# Altium schematic sheet OctopusBotV3R1.SchDoc
size A2
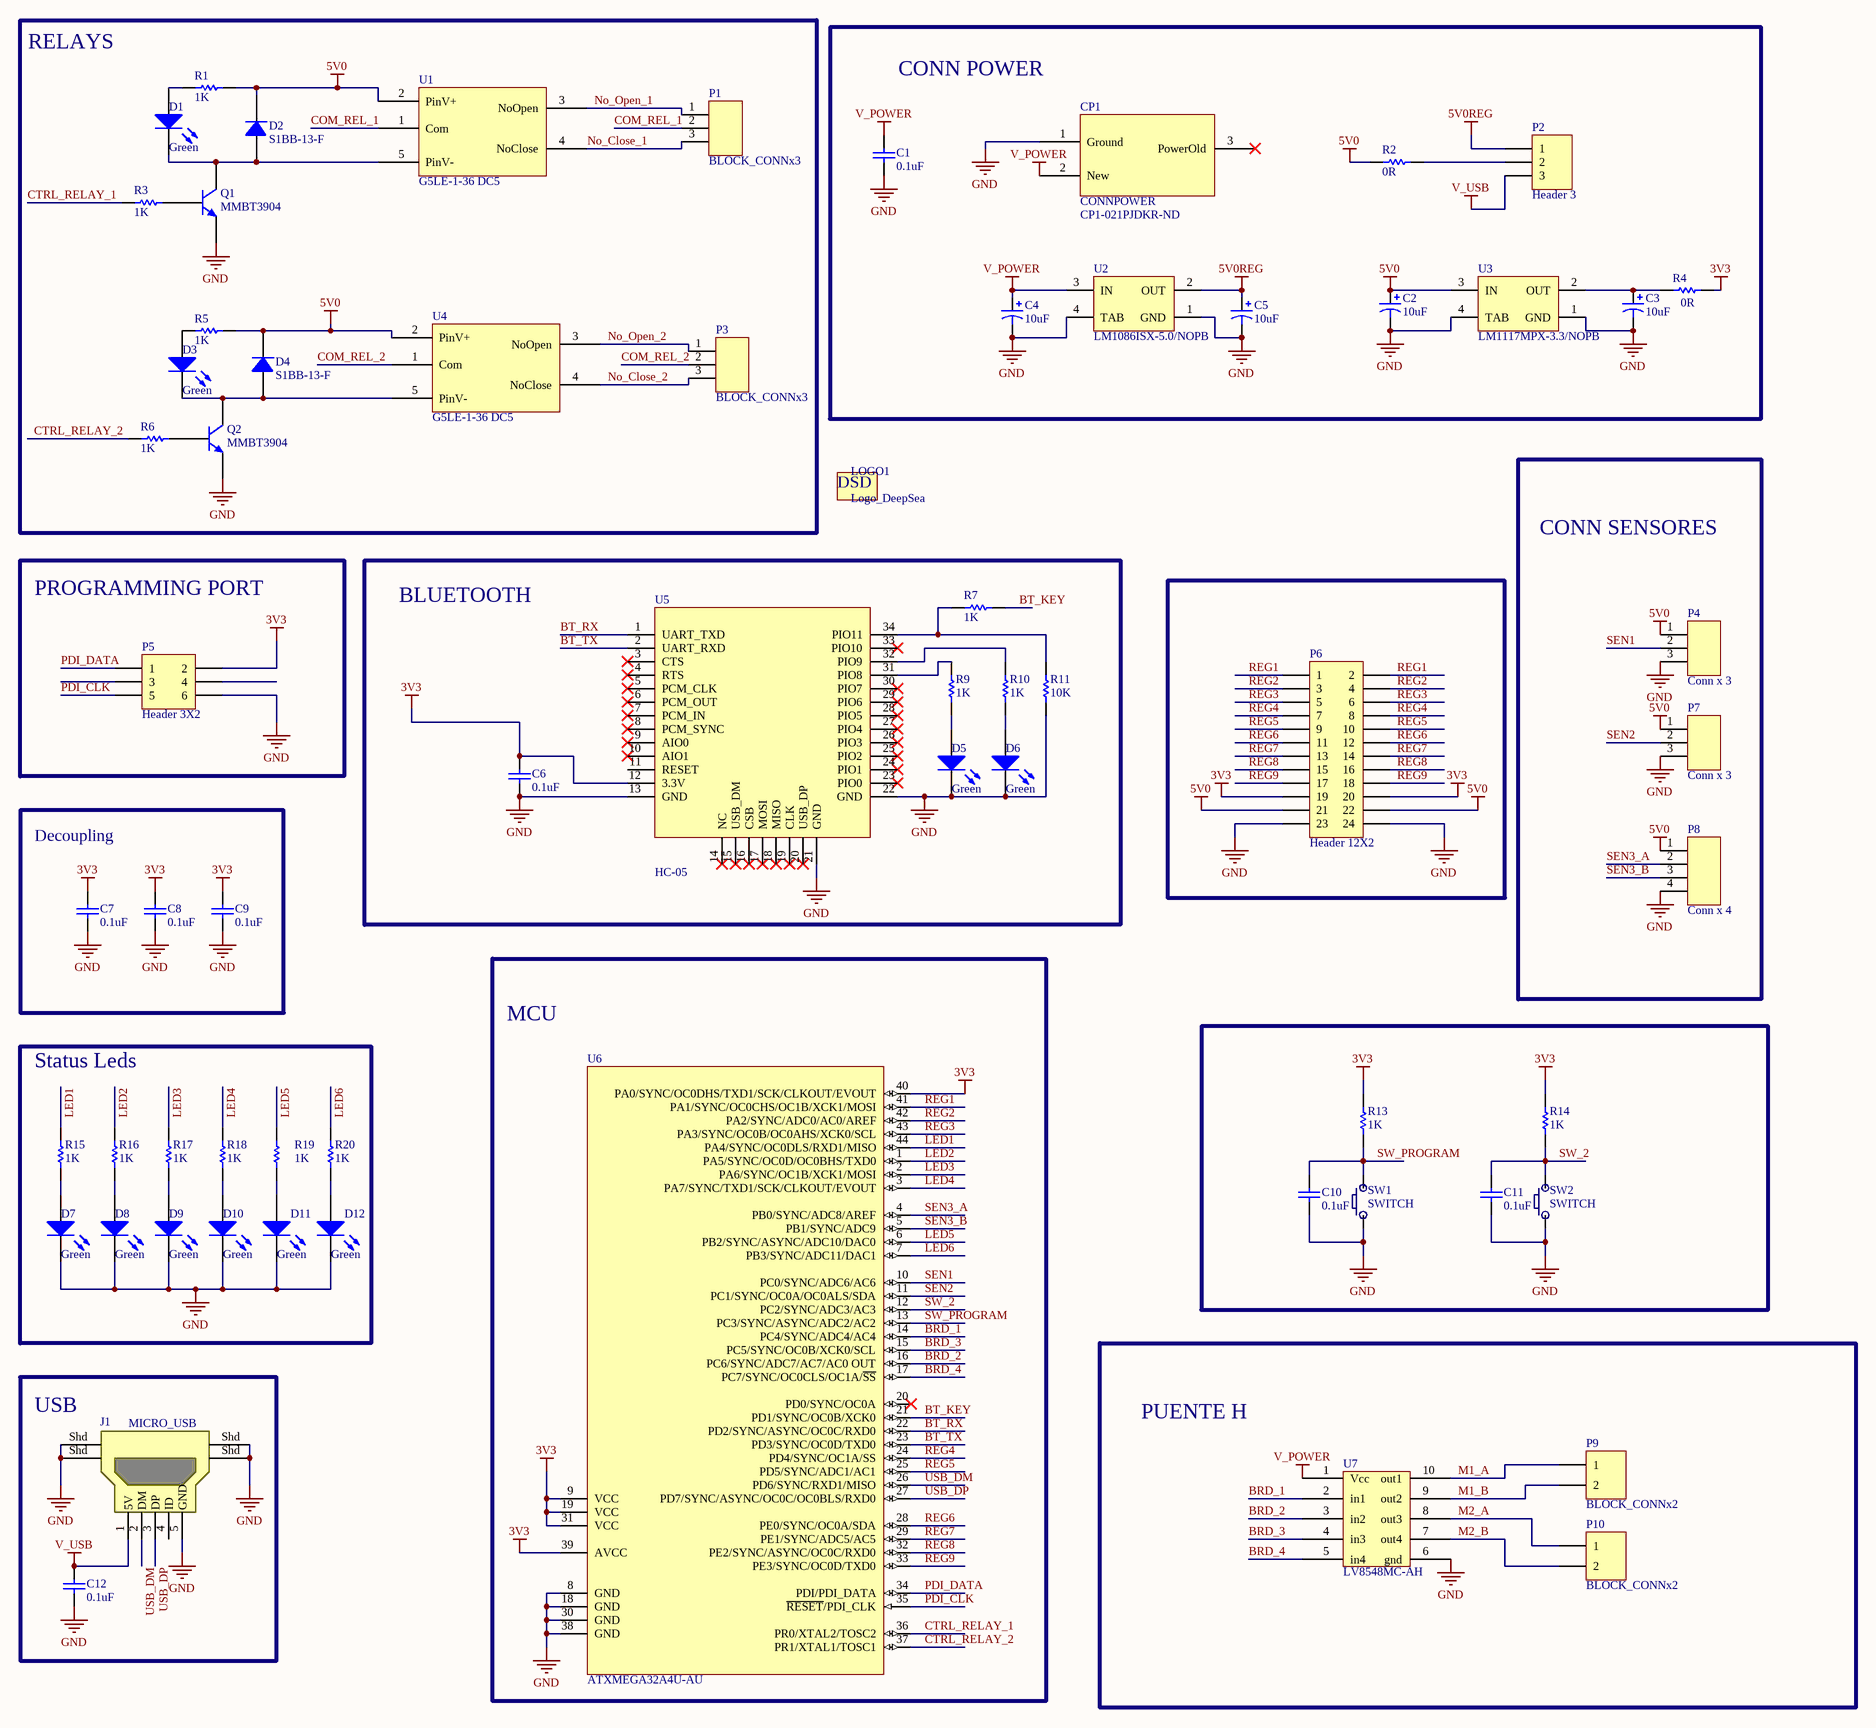
[diagram p0: OctopusBotV3R1.SchDoc]

## Parts
C1  0.1uF  [C0603_N]
C2  10uF  [C_TANT_A_3216_N]
C3  10uF  [C_TANT_A_3216_N]
C4  10uF  [C_TANT_A_3216_N]
C5  10uF  [C_TANT_A_3216_N]
C6  0.1uF  [C0603_N]
C7  0.1uF  [C0603_N]
C8  0.1uF  [C0603_N]
C9  0.1uF  [C0603_N]
C10  0.1uF  [C0603_N]
C11  0.1uF  [C0603_N]
C12  0.1uF  [C0603_N]
CP1  CONNPOWER  Supplier Part Number 1: CP1-021PJDKR-ND  [CONNPOWER]
D1  Green  [R0603_N]
D2  S1BB-13-F  [SMB_M]
D3  Green  [R0603_N]
D4  S1BB-13-F  [SMB_M]
D5  Green  [R0603_N]
D6  Green  [R0603_N]
D7  Green  [R0603_N]
D8  Green  [R0603_N]
D9  Green  [R0603_N]
D10  Green  [R0603_N]
D11  Green  [R0603_N]
D12  Green  [R0603_N]
J1  MICRO_USB  [USB_MICRO_SMD]
LOGO1  Logo_DeepSea  [DeepSea_logo1]
P1  BLOCK_CONNx3  [BLOCK_CONNx3]
P2  Header 3  [HDR1X3]
P3  BLOCK_CONNx3  [BLOCK_CONNx3]
P4  Conn x 3  [conn x 3]
P5  Header 3X2  [HDR2X3]
P6  Header 12X2  [HDR2X12]
P7  Conn x 3  [conn x 3]
P8  Conn x 4  [conn x 4]
P9  BLOCK_CONNx2  [BLOCK_CONNX2]
P10  BLOCK_CONNx2  [BLOCK_CONNX2]
Q1  MMBT3904  [SOT23_N]
Q2  MMBT3904  [SOT23_N]
R1  1K  [R0603_N]
R2  0R  [R0603_N]
R3  1K  [R0603_N]
R4  0R  [R0603_N]
R5  1K  [R0603_N]
R6  1K  [R0603_N]
R7  1K  [R0603_N]
R9  1K  [R0603_N]
R10  1K  [R0603_N]
R11  10K  [R0603_N]
R13  1K  [R0603_N]
R14  1K  [R0603_N]
R15  1K  [R0603_N]
R16  1K  [R0603_N]
R17  1K  [R0603_N]
R18  1K  [R0603_N]
R19  1K  [R0603_N]
R20  1K  [R0603_N]
SW1  SWITCH  [swich_foot]
SW2  SWITCH  [swich_foot]
U1  G5LE-1-36 DC5  [Relay 5V]
U2  LM1086ISX-5.0/NOPB  [TS3B_N]
U3  LM1117MPX-3.3/NOPB  [MP04A_N]
U4  G5LE-1-36 DC5  [Relay 5V]
U5  HC-05  [HC-05]
U6  ATXMEGA32A4U-AU  [44A_N]
U7  LV8548MC-AH  [SOIC10]

## Nets
3V3: C6.2 C7.2 C8.2 C9.2 P5.2 P6.19 P6.20 R4.1 R13.2 R14.2 U5.12(3.3V) U6.9(VCC) U6.19(VCC) U6.31(VCC) U6.39(AVCC) U6.40(PA0/SYNC/OC0DHS/TXD1/SCK/CLKOUT/EVOUT)
5V0: C2.1 D2.2(K) D4.2(K) P4.1 P6.21 P6.22 P7.1 P8.1 R1.2 R2.2 R5.2 U1.2(PinV+) U3.3(IN) U4.2(PinV+)
5V0REG: C5.1 P2.1 U2.2(OUT)
GND: C1.1 C2.2 C3.2 C4.2 C5.2 C6.1 C7.1 C8.1 C9.1 C10.2 C11.2 C12.1 CP1.1(Ground) D5.2(K) D6.2(K) D7.2(K) D8.2(K) D9.2(K) D10.2(K) D11.2(K) D12.2(K) J1.5(GND) J1.Shd P4.3 P5.6 P6.23 P6.24 P7.3 P8.4 Q1.2(E) Q2.2(E) R11.2 SW1.1 SW2.1 U2.1(GND) U2.4(TAB) U3.1(GND) U3.4(TAB) U5.13(GND) U5.21(GND) U5.22(GND) U6.8(GND) U6.18(GND) U6.30(GND) U6.38(GND) U7.6(gnd)
V_POWER: C1.2 C4.1 CP1.2(New) U2.3(IN) U7.1(Vcc)
V_USB: C12.2 J1.1(5V) P2.3
BRD_1: U6.14(PC4/SYNC/ADC4/AC4) U7.2(in1)
BRD_2: U6.16(PC6/SYNC/ADC7/AC7/AC0_OUT) U7.3(in2)
BRD_3: U6.15(PC5/SYNC/OC0B/XCK0/SCL) U7.4(in3)
BRD_4: U6.17(PC7/SYNC/OC0CLS/OC1A/~{SS}) U7.5(in4)
BT_KEY: R7.1 U6.21(PD1/SYNC/OC0B/XCK0)
BT_RX: U5.1(UART_TXD) U6.22(PD2/SYNC/ASYNC/OC0C/RXD0)
BT_TX: U5.2(UART_RXD) U6.23(PD3/SYNC/OC0D/TXD0)
COM_REL_1: P1.2 U1.1(Com)
COM_REL_2: P3.2 U4.1(Com)
CTRL_RELAY_1: R3.1 U6.36(PR0/XTAL2/TOSC2)
CTRL_RELAY_2: R6.1 U6.37(PR1/XTAL1/TOSC1)
LED1: R15.1 U6.44(PA4/SYNC/OC0DLS/RXD1/MISO)
LED2: R16.1 U6.1(PA5/SYNC/OC0D/OC0BHS/TXD0)
LED3: R17.1 U6.2(PA6/SYNC/OC1B/XCK1/MOSI)
LED4: R18.1 U6.3(PA7/SYNC/TXD1/SCK/CLKOUT/EVOUT)
LED5: R19.1 U6.6(PB2/SYNC/ASYNC/ADC10/DAC0)
LED6: R20.1 U6.7(PB3/SYNC/ADC11/DAC1)
M1_A: P9.1 U7.10(out1)
M1_B: P9.2 U7.9(out2)
M2_A: P10.1 U7.8(out3)
M2_B: P10.2 U7.7(out4)
No_Close_1: P1.3 U1.4(NoClose)
No_Close_2: P3.3 U4.4(NoClose)
No_Open_1: P1.1 U1.3(NoOpen)
No_Open_2: P3.1 U4.3(NoOpen)
PDI_CLK: P5.5 U6.35(~{RESET}/PDI_CLK)
PDI_DATA: P5.1 U6.34(PDI/PDI_DATA)
REG1: P6.1 P6.2 U6.41(PA1/SYNC/OC0CHS/OC1B/XCK1/MOSI)
REG2: P6.3 P6.4 U6.42(PA2/SYNC/ADC0/AC0/AREF)
REG3: P6.5 P6.6 U6.43(PA3/SYNC/OC0B/OC0AHS/XCK0/SCL)
REG4: P6.7 P6.8 U6.24(PD4/SYNC/OC1A/SS)
REG5: P6.9 P6.10 U6.25(PD5/SYNC/ADC1/AC1)
REG6: P6.11 P6.12 U6.28(PE0/SYNC/OC0A/SDA)
REG7: P6.13 P6.14 U6.29(PE1/SYNC/ADC5/AC5)
REG8: P6.15 P6.16 U6.32(PE2/SYNC/ASYNC/OC0C/RXD0)
REG9: P6.17 P6.18 U6.33(PE3/SYNC/OC0D/TXD0)
SEN1: P4.2 U6.10(PC0/SYNC/ADC6/AC6)
SEN2: P7.2 U6.11(PC1/SYNC/OC0A/OC0ALS/SDA)
SEN3_A: P8.2 U6.4(PB0/SYNC/ADC8/AREF)
SEN3_B: P8.3 U6.5(PB1/SYNC/ADC9)
SW_2: C11.1 R14.1 SW2.2 U6.12(PC2/SYNC/ADC3/AC3)
SW_PROGRAM: C10.1 R13.1 SW1.2 U6.13(PC3/SYNC/ASYNC/ADC2/AC2)
USB_DM: J1.2(DM) U6.26(PD6/SYNC/RXD1/MISO)
USB_DP: J1.3(DP) U6.27(PD7/SYNC/ASYNC/OC0C/OC0BLS/RXD0)
NetC3_1: C3.1 R4.2 U3.2(OUT)
NetD1_1: D1.1(A) R1.1
NetD1_2: D1.2(K) D2.1(A) Q1.3(C) U1.5(PinV-)
NetD3_1: D3.1(A) R5.1
NetD3_2: D3.2(K) D4.1(A) Q2.3(C) U4.5(PinV-)
NetD5_1: D5.1(A) R9.2
NetD6_1: D6.1(A) R10.2
NetD7_1: D7.1(A) R15.2
NetD8_1: D8.1(A) R16.2
NetD9_1: D9.1(A) R17.2
NetD10_1: D10.1(A) R18.2
NetD11_1: D11.1(A) R19.2
NetD12_1: D12.1(A) R20.2
NetP2_2: P2.2 R2.1
NetQ1_1: Q1.1(B) R3.2
NetQ2_1: Q2.1(B) R6.2
NetR7_2: R7.2 R11.1 U5.34(PIO11)
NetR9_1: R9.1 U5.31(PIO8)
NetR10_1: R10.1 U5.32(PIO9)

Not connected (* = marked no-connect by the designer): CP1 3(PowerOld)*; J1 4(ID); P5 3 4; U5 3(CTS)* 4(RTS)* 5(PCM_CLK)* 6(PCM_OUT)* 7(PCM_IN)* 8(PCM_SYNC)* 9(AIO0)* 10(AIO1)* 11(RESET) 14(NC)* 15(USB_DM)* 16(CSB)* 17(MOSI)* 18(MISO)* 19(CLK)* 20(USB_DP)* 23(PIO0)* 24(PIO1)* 25(PIO2)* 26(PIO3)* 27(PIO4)* 28(PIO5)* 29(PIO6)* 30(PIO7)* 33(PIO10)*; U6 20(PD0/SYNC/OC0A)*

## Notes on the sheet
- (near R1) RELAYS
- CONN POWER
- CONN SENSORES
- PROGRAMMING PORT
- BLUETOOTH
- Decoupling
- MCU
- Status Leds
- (near J1) USB
- PUENTE H
- (in symbol Logo_DeepSea) DSD

## Library data of the parts
C1 C6-C12 = C_SMD: Value: 0.1uF
C2-C5 = CP_SMD: Value: 10uF
D1 D3 D5-D12 = LED_SMD: Color: Green
D2 D4 = S1BB-13-F: DIODE GEN PURPOSE 100V 1A SMB; Manufacturer: Diodes Incorporated; Diode Type: Standard; Voltage - Forward (Vf) (Max) @ If: 1.1V @ 1A; Speed: Standard Recovery >500ns, > 200mA (Io); Reverse Recovery Time (trr): 3µs; Current - Reverse Leakage @ Vr: 5µA @ 100V; Capacitance @ Vr, F: 10pF @ 4V, 1MHz; Supplier 1: Digi-Key; Manufacturer Part Number: S1BB-13-F; RoHS: RoHS Compliant; Category: Discrete Semiconductor Products; Stock 1: 11988; Pricing 1: 1=0.43, 10=0.306, 25=0.2416, 100=0.1836, 250=0.13004, 500=0.10404, 1000=0.078 (USD); Packaging: Cut Tape (CT); Voltage - DC Reverse (Vr) (Max): 100V; Current - Average Rectified (Io): 1A; Mounting Type: Surface Mount; Package / Case: DO-214AA, SMB; Supplier Device Package: SMB; Operating Temperature - Junction: -65°C ~ 150°C; ComponentLink1URL: http://www.diodes.com/datasheets/ds16003.pdf; ComponentLink1Description: http://www.diodes.com/datasheets/ds16003.pdf; Supplier Part Number 1: S1BB-FDICT-ND
J1 = MICRO_USB: CONN USB MICRO B RECPT SMT R/A; Manufacturer: FCI; Manufacturer Part Number: 10118194-0001LF; Connector Type: USB - micro B; Number of Contacts: 5; Gender: Receptacle; Specifications: USB 2.0; Supplier 1: Digi-Key; RoHS: RoHS Compliant; Category: Connectors, Interconnects; Stock 1: 9139; Pricing 1: 1=0.46, 10=0.433, 25=0.3712, 50=0.3156, 100=0.3032, 250=0.27224, 500=0.25988 (USD); Packaging: Cut Tape (CT); Mounting Type: Surface Mount, Right Angle, Horizontal; Features: Shielded, Solder Retention; Ingress Protection: -; ComponentLink1URL: http://portal.fciconnect.com/Comergent//fci/drawing/10118194.pdf; ComponentLink1Description: http://portal.fciconnect.com/Comergent//fci/drawing/10118194.pdf; Supplier Part Number 1: 609-4618-1-ND
P1 P3 = BLOCK_CONNx3: TERM BLOCK 5.08MM VERT 3POS PCB; Manufacturer: On Shore Technology Inc; Manufacturer Part Number: OSTTC032162; Number of Levels: 1; Positions Per Level: 3; Pitch: 0.200" (5.08mm); Mating Orientation: Horizontal with Board; Current: 15A; Voltage: 300V; Wire Gauge: 14-22 AWG; Wire Termination: Screw - Leaf Spring, Wire Guard; Clamp Material - Plating: Steel, Stainless; Screw Material - Plating: Steel - Zinc Plated; Torque - Screw: 0.3 Nm (2.6 Lb-In); Screw Thread: M2.6; Supplier 1: Digi-Key; RoHS: RoHS Compliant; Category: Connectors, Interconnects; Stock 1: 4040; Pricing 1: 1=0.51, 10=0.48, 50=0.384, 100=0.368, 250=0.336, 500=0.32, 1000=0.264, 2500=0.24, 5000=0.232 (USD); Packaging: Bulk; Mounting Type: Through Hole; Features: Interlocking (Side); Color: Blue; Operating Temperature: -30°C ~ 105°C; Housing Material: Thermoplastic; Contact Material - Plating: Tin Plated; ComponentLink1URL: http://www.on-shore.com/sites/default/files/manuals/osttcxx2162.pdf; ComponentLink1Description: http://www.on-shore.com/sites/default/files/manuals/osttcxx2162.pdf; Supplier Part Number 1: ED2610-ND
P2 = Header 3: Header, 3-Pin; LatestRevisionDate: 17-Jul-2002; LatestRevisionNote: Re-released for DXP Platform.; Publisher: Altium Limited
P4 P7 = Conn x 3: CONN HEADER VERT 3POS .100 TIN; Manufacturer: TE Connectivity; Manufacturer Part Number: 640456-3; Connector Type: Header, Unshrouded; Number of Positions: 3; Number of Positions Loaded: All; Pitch: 0.100" (2.54mm); Supplier 1: Digi-Key; RoHS: RoHS Compliant; Category: Connectors, Interconnects; Stock 1: 62912; Pricing 1: 1=0.2, 10=0.185, 50=0.118, 100=0.1141, 250=0.09832, 500=0.0944, 1000=0.08259, 2500=0.07473, 5000=0.07079 (USD); Packaging: Bulk; Contact Type: Male Pin; Number of Rows: 1; Row Spacing: -; Contact Mating Length: 0.295" (7.49mm); Mounting Type: Through Hole; Termination: Solder; Fastening Type: Friction Lock; Features: -; Contact Finish: Tin; Contact Finish Thickness: -; Color: Natural; ComponentLink1URL: http://www.te.com/commerce/DocumentDelivery/DDEController?Action=srchrtrv&DocNm=640456&DocType=Customer+Drawing&DocLang=English; ComponentLink1Description: http://www.te.com/commerce/DocumentDelivery/DDEController?Action=srchrtrv&DocNm=640456&DocType=Customer+Drawing&DocLang=English; Supplier Part Number 1: A19470-ND
P5 = Header 3X2: Header, 3-Pin, Dual row; LatestRevisionDate: 17-Jul-2002; LatestRevisionNote: Re-released for DXP Platform.; Publisher: Altium Limited
P6 = Header 12X2: Header, 12-Pin, Dual row; LatestRevisionDate: 17-Jul-2002; LatestRevisionNote: Re-released for DXP Platform.; Publisher: Altium Limited
P8 = Conn x 4: CONN HEADER VERT 4POS .100 TIN; Manufacturer: TE Connectivity; Manufacturer Part Number: 640454-4; Connector Type: Header, Unshrouded; Number of Positions: 4; Number of Positions Loaded: All; Pitch: 0.100" (2.54mm); Supplier 1: Digi-Key; RoHS: RoHS Compliant; Category: Connectors, Interconnects; Stock 1: 24607; Pricing 1: 1=0.18, 10=0.164, 50=0.1228, 100=0.114, 250=0.10088, 500=0.0965, 1000=0.07895, 2500=0.07237, 5000=0.07018 (USD); Packaging: Bulk; Contact Type: Male Pin; Number of Rows: 1; Row Spacing: -; Contact Mating Length: 0.295" (7.49mm); Mounting Type: Through Hole; Termination: Solder; Fastening Type: -; Features: Polarizing Key; Contact Finish: Tin; Contact Finish Thickness: -; Color: Natural; ComponentLink1URL: http://www.te.com/commerce/DocumentDelivery/DDEController?Action=srchrtrv&DocNm=640454&DocType=Customer+Drawing&DocLang=English; ComponentLink1Description: http://www.te.com/commerce/DocumentDelivery/DDEController?Action=srchrtrv&DocNm=640454&DocType=Customer+Drawing&DocLang=English; Supplier Part Number 1: A19431-ND
P9 P10 = BLOCK_CONNx2: TERM BLOCK 5.08MM VERT 2POS PCB; Manufacturer: On Shore Technology Inc; Manufacturer Part Number: OSTTC022162; Number of Levels: 1; Positions Per Level: 2; Pitch: 0.200" (5.08mm); Mating Orientation: Horizontal with Board; Current: 15A; Voltage: 300V; Wire Gauge: 14-22 AWG; Wire Termination: Screw - Leaf Spring, Wire Guard; Clamp Material - Plating: Steel, Stainless; Screw Material - Plating: Steel - Zinc Plated; Torque - Screw: 0.3 Nm (2.6 Lb-In); Screw Thread: M2.6; Supplier 1: Digi-Key; RoHS: RoHS Compliant; Category: Connectors, Interconnects; Stock 1: 37906; Pricing 1: 1=0.41, 10=0.385, 50=0.2806, 100=0.2695, 250=0.242, 500=0.231, 1000=0.1925, 2500=0.176, 5000=0.165 (USD); Packaging: Bulk; Mounting Type: Through Hole; Features: Interlocking (Side); Color: Blue; Operating Temperature: -30°C ~ 105°C; Housing Material: Thermoplastic; Contact Material - Plating: Tin Plated; ComponentLink1URL: http://www.on-shore.com/sites/default/files/manuals/osttcxx2162.pdf; ComponentLink1Description: http://www.on-shore.com/sites/default/files/manuals/osttcxx2162.pdf; Supplier Part Number 1: ED2609-ND
Q1 Q2 = MMBT3904: NPN Switching Transistor; Manufacturer: Micro Commercial Co; Manufacturer Part Number: MMBT3904-TP; Current - Collector (Ic) (Max): 200mA; Voltage - Collector Emitter Breakdown (Max): 40V; Vce Saturation (Max) @ Ib, Ic: 300mV @ 5mA, 50mA; DC Current Gain (hFE) (Min) @ Ic, Vce: 100 @ 10mA, 1V; Power - Max: 350mW; Frequency - Transition: 300MHz; Published: 17-Sep-2003; LatestRevisionDate: 12-Dec-2006; LatestRevisionNote: IPC-7351 Footprint Added.; DatasheetVersion: 13-May-2002; PackageVersion: May-1999; PackageReference: SOT23; Publisher: Altium Limited; PackageDescription: 3-Pin SOT-23 Package 0.95 mm Pitch, 2.3 mm Lead Span; ComponentLink1Description: Manufacturer Link; ComponentLink1URL: http://www.semiconductors.philips.com/; ComponentLink2Description: Datasheet; ComponentLink2URL: http://www.semiconductors.philips.com/acrobat/datasheets/MMBT3904_4.pdf; Supplier 1: Digi-Key; RoHS: RoHS Compliant; Category: Discrete Semiconductor Products; Stock 1: 101484; Pricing 1: 1=0.14, 10=0.127, 25=0.116, 100=0.0834, 250=0.04916, 500=0.04078, 1000=0.02781 (USD); Packaging: Cut Tape (CT); Transistor Type: NPN; Current - Collector Cutoff (Max): -; Mounting Type: Surface Mount; Package / Case: TO-236-3, SC-59, SOT-23-3; Supplier Device Package: SOT-23; ComponentLink3URL: http://www.mccsemi.com/up_pdf/MMBT3904(SOT-23).pdf; ComponentLink3Description: http://www.mccsemi.com/up_pdf/MMBT3904(SOT-23).pdf; Supplier Part Number 1: MMBT3904TPMSCT-ND
R1-R7 R9-R11 R13-R20 = R_SMD
  R1 R3 R5-R7 R9 R10 R13-R20: Value: 1K
  R2 R4: Value: 0R
  R11: Value: 10K
SW1 SW2 = SWITCH: SWITCH TACTILE SPST-NO 0.05A 12V; Manufacturer: TE Connectivity; Manufacturer Part Number: FSM4JSMATR; Switch Function: Off-Mom; Contact Rating @ Voltage: 0.05A @ 12VDC; Actuator Type: Standard; Actuator Height off PCB, from Pins: 5.00mm; Actuator Orientation: Top Actuated; Outline: 6.00mm x 6.00mm; Illumination: Non-Illuminated; Operating Force: 160gf; Actuator Material: Polyphenylene Sulfide (PPS); Switch Travel: 0.25mm; Mechanical Life: 100,000 Cycles; Supplier 1: Digi-Key; RoHS: RoHS Compliant; Category: Switches; Stock 1: 33712; Pricing 1: 1=0.23, 10=0.223, 25=0.2136, 50=0.2038, 100=0.1843, 250=0.1698, 500=0.15524 (USD); Packaging: Cut Tape (CT); Circuit: SPST-NO; Mounting Type: Surface Mount; Termination Style: Gull Wing; Illumination Voltage (Nominal): -; Illumination Type, Color: -; Ingress Protection: -; Features: -; Operating Temperature: -35°C ~ 85°C; ComponentLink1URL: http://www.te.com/commerce/DocumentDelivery/DDEController?Action=srchrtrv&DocNm=2-1437565-7&DocType=Customer+Drawing&DocLang=English; ComponentLink1Description: http://www.te.com/commerce/DocumentDelivery/DDEController?Action=srchrtrv&DocNm=2-1437565-7&DocType=Customer+Drawing&DocLang=English; Supplier Part Number 1: 450-1759-1-ND
U1 U4 = G5LE-1-36 DC5: RELAY GEN PURPOSE SPDT 10A 5V; Manufacturer: Omron Electronics Inc-EMC Div; Relay Type: General Purpose; Coil Type: Non Latching; Coil Current: 72mA; Coil Voltage: 5VDC; Contact Form: SPDT (1 Form C); Switching Voltage: 250VAC, 125VDC - Max; Turn On Voltage (Max): 3.75 VDC; Turn Off Voltage (Min): 0.5 VDC; Operate Time: 10ms; Release Time: 5ms; Coil Power: 360 mW; Coil Resistance: 70 Ohms; Supplier 1: Digi-Key; Manufacturer Part Number: G5LE-1-36 DC5; RoHS: RoHS Compliant; Category: Relays; Stock 1: 20; Pricing 1: 1=1.45, 10=1.361, 25=1.21, 50=1.1494, 100=1.0889, 250=0.96788, 500=0.90738, 1000=0.84689, 2500=0.83176 (USD); Packaging: Bulk; Contact Rating (Current): 10A; Features: Insulation - Class B, Sealed - Flux Protection; Mounting Type: Through Hole; Termination Style: PC Pin; Contact Material: Silver Tin Oxide (AgSnO); Operating Temperature: -40°C ~ 85°C; ComponentLink1URL: http://www.components.omron.com/components/web/PDFLIB.nsf/0/0293ACA6B03161CD86257538007424DB/$file/G5LE_0813.pdf; ComponentLink1Description: http://www.components.omron.com/components/web/PDFLIB.nsf/0/0293ACA6B03161CD86257538007424DB/$file/G5LE_0813.pdf; Supplier Part Number 1: G5LE-1-36DC5-ND
U2 = LM1086ISX-5.0/NOPB: 1.5A Low Dropout Positive Regulators, 3-pin TO-263, Pb-Free; Manufacturer: National Semiconductor; PackageTopMarking: NSUZXYTTE#*LM1086*IS-5.0; PowerWise: N; CompType: LDO IC; Published: 1-Mar-2010; DatasheetVersion: Jun-2005; PackageVersion: revF, Apr-2005; PackageReference: TS3B; Publisher: Altium Limited; PackageDescription: TO-263, Molded, .400 x .390 x .180in, 3 Lead, .1in Pitch, Surface Mount; Supplier 1: Digi-Key; Supplier Part Number 1: LM1086ISX-5.0-ND; PartNumber: LM1086ISX-5.0/NOPB; RoHS: Y; PinCount: 3; Code_JEDEC: MO-169-AA; ComponentLink1Description: LM1086 Datasheet; ComponentLink1URL: http://www.national.com/ds/LM/LM1086.pdf; ComponentLink2Description: LM1086 Web Page; ComponentLink2URL: http://www.national.com/pf/LM/LM1086.html; ComponentLink3Description: TS3B Package Page; ComponentLink3URL: http://www.national.com/packaging/folders/ts3b.html
U3 = LM1117MPX-3.3/NOPB: 800mA Low-Dropout Linear Regulator, 4-pin SOT-223, Pb-Free; Manufacturer: National Semiconductor; PackageTopMarking: XYTT*N05A; PowerWise: N; CompType: LDO IC; Regulator Topology: Positive Fixed; Voltage - Output: 3.3V; Voltage - Dropout (Typical): 1.2V @ 800mA; Number of Regulators: 1; Voltage - Input: Up to 15V; Published: 1-Mar-2010; DatasheetVersion: Apr-2006; PackageVersion: revB, Apr-2003; PackageReference: MP04A; Publisher: Altium Limited; PackageDescription: Molded SOT-223, 6.50 x 3.56 x 1.6mm Body, 4 Lead, 2.3mm Pitch; Supplier 1: Digi-Key; Supplier Part Number 1: LM1117MPX-3.3TR-ND; Supplier 2: Digi-Key; Supplier Part Number 2: LM1117MPX-3.3CT-ND; Supplier 3: Digi-Key; Supplier Part Number 3: LM1117MPX-3.3DKR-ND; PartNumber: LM1117MPX-3.3/NOPB; RoHS: Y; PinCount: 4; Code_JEDEC: TO-261-AA; Code_IPC: SOT223-4; ComponentLink1Description: LM1117 Datasheet; ComponentLink1URL: http://www.national.com/ds/LM/LM1117.pdf; ComponentLink2Description: LM1117 Web Page; ComponentLink2URL: http://www.national.com/pf/LM/LM1117.html; ComponentLink3Description: MP04A Package Page; ComponentLink3URL: http://www.national.com/packaging/folders/mp04a.html; Supplier 4: Digi-Key; Manufacturer Part Number: LM1117MPX-3.3/NOPB; Category: Integrated Circuits (ICs); Stock 4: 15124; Pricing 4: 1=1.1, 10=0.973, 25=0.8784, 100=0.7686, 250=0.67404, 500=0.5978, 750=0.52155, 1000=0.47275 (USD); Packaging: Cut Tape (CT); Current - Output: 800mA; Current - Limit (Min): 800mA; Operating Temperature: 0°C ~ 125°C; Mounting Type: Surface Mount; Package / Case: TO-261-4, TO-261AA; Supplier Device Package: SOT-223; ComponentLink4URL: http://www.ti.com/lit/ds/symlink/lm1117-n.pdf; ComponentLink4Description: http://www.ti.com/lit/ds/symlink/lm1117-n.pdf; Supplier Part Number 4: LM1117MPX-3.3/NOPBCT-ND
U5 = HC-05: Bluetooth RS232 module
U6 = ATXMEGA32A4U-AU: IC MCU 8BIT 32KB FLASH 44TQFP; Manufacturer: Atmel; Core Processor: AVR; Core Size: 8/16-Bit; Speed: 32MHz; Connectivity: I²C, IrDA, SPI, UART/USART, USB; Peripherals: Brown-out Detect/Reset, DMA, POR, PWM, WDT; Number of I /O: 34; Program Memory Size: 32KB (16K x 16); EEPROM Size: 2K x 8; RAM Size: 4K x 8; Voltage - Supply (Vcc/Vdd): 1.6 V ~ 3.6 V; Data Converters: A/D 12x12b, D/A 2x12b; Oscillator Type: Internal; Supplier 1: Digi-Key; RoHS: RoHS Compliant; Category: Integrated Circuits (ICs); Stock 1: 2077; Pricing 1: 1=3.43, 25=2.1548, 100=1.9152 (USD); Packaging: Tray; Program Memory Type: FLASH; Operating Temperature: -40°C ~ 85°C; Package / Case: 44-TQFP; ComponentLink1URL: http://www.atmel.com/Images/Atmel-8387-8-and16-bit-AVR-Microcontroller-XMEGA-A4U_Datasheet.pdf; ComponentLink1Description: http://www.atmel.com/Images/Atmel-8387-8-and16-bit-AVR-Microcontroller-XMEGA-A4U_Datasheet.pdf; Supplier Part Number 1: ATXMEGA32A4U-AU-ND; Manufacturer Part Number: ATXMEGA32A4U-AU
U7 = LV8548MC-AH: IC MOTOR DRIVER PAR MFP10S; Manufacturer: ON Semiconductor; Motor Type - Stepper: Bipolar; Motor Type - AC, DC: Brushed DC; Function: Power Bridge - Logic Driven Power Stage; Output Configuration: Full H-Bridge, (2) Dual; Interface: Parallel; Current - Output: 1A; Voltage - Supply: 4 V ~ 16 V; Supplier 1: Digi-Key; Supplier Part Number 1: 869-1287-6-ND; Supplier 2: Digi-Key; Manufacturer Part Number: LV8548MC-AH; RoHS: RoHS Compliant; Category: Integrated Circuits (ICs); Stock 2: 2255; Pricing 2: 1=1.41, 10=1.244, 25=1.1232, 100=0.9828, 250=0.86192, 500=0.7644, 1000=0.6045 (USD); Packaging: Cut Tape (CT); Applications: General Purpose; Voltage - Load: 4 V ~ 16 V; Operating Temperature: -30°C ~ 85°C; Mounting Type: Surface Mount; Package / Case: 10-LSOP (0.173", 4.40mm Width); Supplier Device Package: MFP10S; ComponentLink1URL: http://www.onsemi.com/pub_link/Collateral/ENA2038-D.PDF; ComponentLink1Description: http://www.onsemi.com/pub_link/Collateral/ENA2038-D.PDF; Supplier Part Number 2: 869-1287-1-ND
CP1 = CONNPOWER: Supplier 1: Digi-Key